# Altium schematic sheet P18_CAMERA_MIPI LCD.SchDoc
size 594 x 420 mm
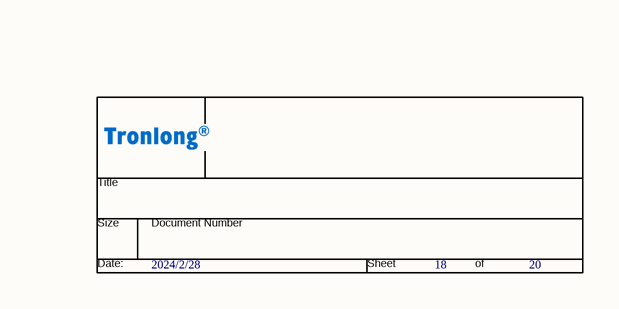
[diagram p0: P18_CAMERA_MIPI LCD.SchDoc, right]

## Parts
*  Page Count: 20  Page Number: 18  Page Modify Date: 2024/2/28  (hidden comment: Tronlong_TITTLE_20211115)  (graphical)

## Notes on the sheet
- (in symbol Tronlong_TITTLE_20211115) Title; Size; Document Number; Date:; Sheet; of

## Library data of the parts
* = Tronlong_TITTLE_20211115: RevCode: A?; Page Create Date: March  8, 1995